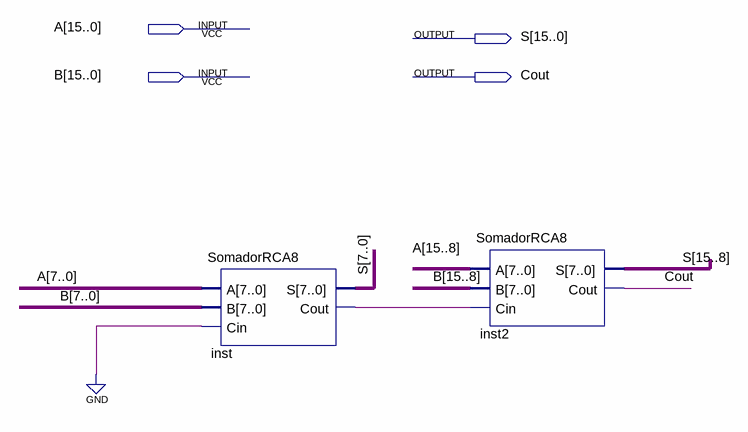
[diagram p0: schematic sheet]
// Quartus schematic RCA16.bdf as structural Verilog: 2 symbols, 4 pins
module RCA16 (
  input  [15:0] A,
  input  [15:0] B,
  output [15:0] S,
  output Cout
);

  wire inst_cout;

  SomadorRCA8 inst (.A(A[7:0]), .B(B[7:0]), .Cin(1'b0), .S(S[7:0]), .Cout(inst_cout));
  SomadorRCA8 inst2 (.A(A[15:8]), .B(B[15:8]), .Cin(inst_cout), .S(S[15:8]), .Cout(Cout));
endmodule
